# Altium schematic sheet uAMDC2.SchDoc: uAMDC
size 279 x 241 mm; Engineer: Prasoon Sinha; SheetNumber: 2; SheetTotal: 2
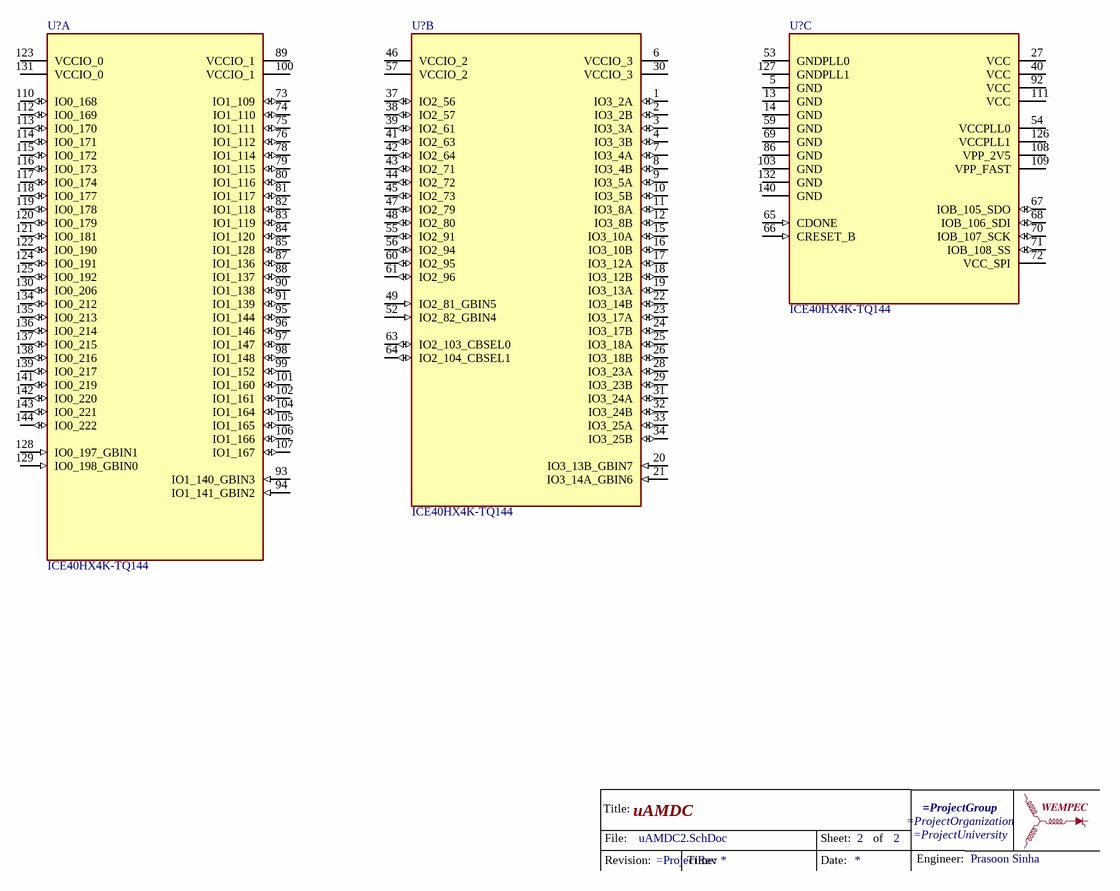
[diagram p0: uAMDC2.SchDoc]

## Parts
(Parts that share a designator on the sheet are numbered #1, #2 ... from top to bottom, then left to right.)
*?  TitleBlockWEMPEC  (value not drawn)  (graphical)
U?#1  ICE40HX4K-TQ144  [QFP50P2200X2200X160-144N]  (part C of 3)
U?#2  ICE40HX4K-TQ144  [QFP50P2200X2200X160-144N]  (part B of 3)
U?#3  ICE40HX4K-TQ144  [QFP50P2200X2200X160-144N]  (part A of 3)

## Nets

Not connected (* = marked no-connect by the designer): U?#1 5(GND) 13(GND) 14(GND) 27(VCC) 40(VCC) 53(GNDPLL0) 54(VCCPLL0) 59(GND) 65(CDONE) 66(CRESET_B) 67(IOB_105_SDO) 68(IOB_106_SDI) 69(GND) 70(IOB_107_SCK) 71(IOB_108_SS) 72(VCC_SPI) 86(GND) 92(VCC) 103(GND) 108(VPP_2V5) 109(VPP_FAST) 111(VCC) 126(VCCPLL1) 127(GNDPLL1) 132(GND) 140(GND); U?#2 1(IO3_2A) 2(IO3_2B) 3(IO3_3A) 4(IO3_3B) 6(VCCIO_3) 7(IO3_4A) 8(IO3_4B) 9(IO3_5A) 10(IO3_5B) 11(IO3_8A) 12(IO3_8B) 15(IO3_10A) 16(IO3_10B) 17(IO3_12A) 18(IO3_12B) 19(IO3_13A) 20(IO3_13B_GBIN7) 21(IO3_14A_GBIN6) 22(IO3_14B) 23(IO3_17A) 24(IO3_17B) 25(IO3_18A) 26(IO3_18B) 28(IO3_23A) 29(IO3_23B) 30(VCCIO_3) 31(IO3_24A) 32(IO3_24B) 33(IO3_25A) 34(IO3_25B) 37(IO2_56) 38(IO2_57) 39(IO2_61) 41(IO2_63) 42(IO2_64) 43(IO2_71) 44(IO2_72) 45(IO2_73) 46(VCCIO_2) 47(IO2_79) 48(IO2_80) 49(IO2_81_GBIN5) 52(IO2_82_GBIN4) 55(IO2_91) 56(IO2_94) 57(VCCIO_2) 60(IO2_95) 61(IO2_96) 63(IO2_103_CBSEL0) 64(IO2_104_CBSEL1); U?#3 73(IO1_109) 74(IO1_110) 75(IO1_111) 76(IO1_112) 78(IO1_114) 79(IO1_115) 80(IO1_116) 81(IO1_117) 82(IO1_118) 83(IO1_119) 84(IO1_120) 85(IO1_128) 87(IO1_136) 88(IO1_137) 89(VCCIO_1) 90(IO1_138) 91(IO1_139) 93(IO1_140_GBIN3) 94(IO1_141_GBIN2) 95(IO1_144) 96(IO1_146) 97(IO1_147) 98(IO1_148) 99(IO1_152) 100(VCCIO_1) 101(IO1_160) 102(IO1_161) 104(IO1_164) 105(IO1_165) 106(IO1_166) 107(IO1_167) 110(IO0_168) 112(IO0_169) 113(IO0_170) 114(IO0_171) 115(IO0_172) 116(IO0_173) 117(IO0_174) 118(IO0_177) 119(IO0_178) 120(IO0_179) 121(IO0_181) 122(IO0_190) 123(VCCIO_0) 124(IO0_191) 125(IO0_192) 128(IO0_197_GBIN1) 129(IO0_198_GBIN0) 130(IO0_206) 131(VCCIO_0) 134(IO0_212) 135(IO0_213) 136(IO0_214) 137(IO0_215) 138(IO0_216) 139(IO0_217) 141(IO0_219) 142(IO0_220) 143(IO0_221) 144(IO0_222)

## Notes on the sheet
- (in symbol TitleBlockWEMPEC) Title:; File:; Sheet:; of; Engineer:; Revision:; Time:; Date:

## Library data of the parts
U?#1-U?#3 = ICE40HX4K-TQ144: IC FPGA 107 I/O 144TQFP; Supplier Part Number 1: 220-1572-ND